# EAGLE design Thruster-Commander (EAGLE 7.4.0)
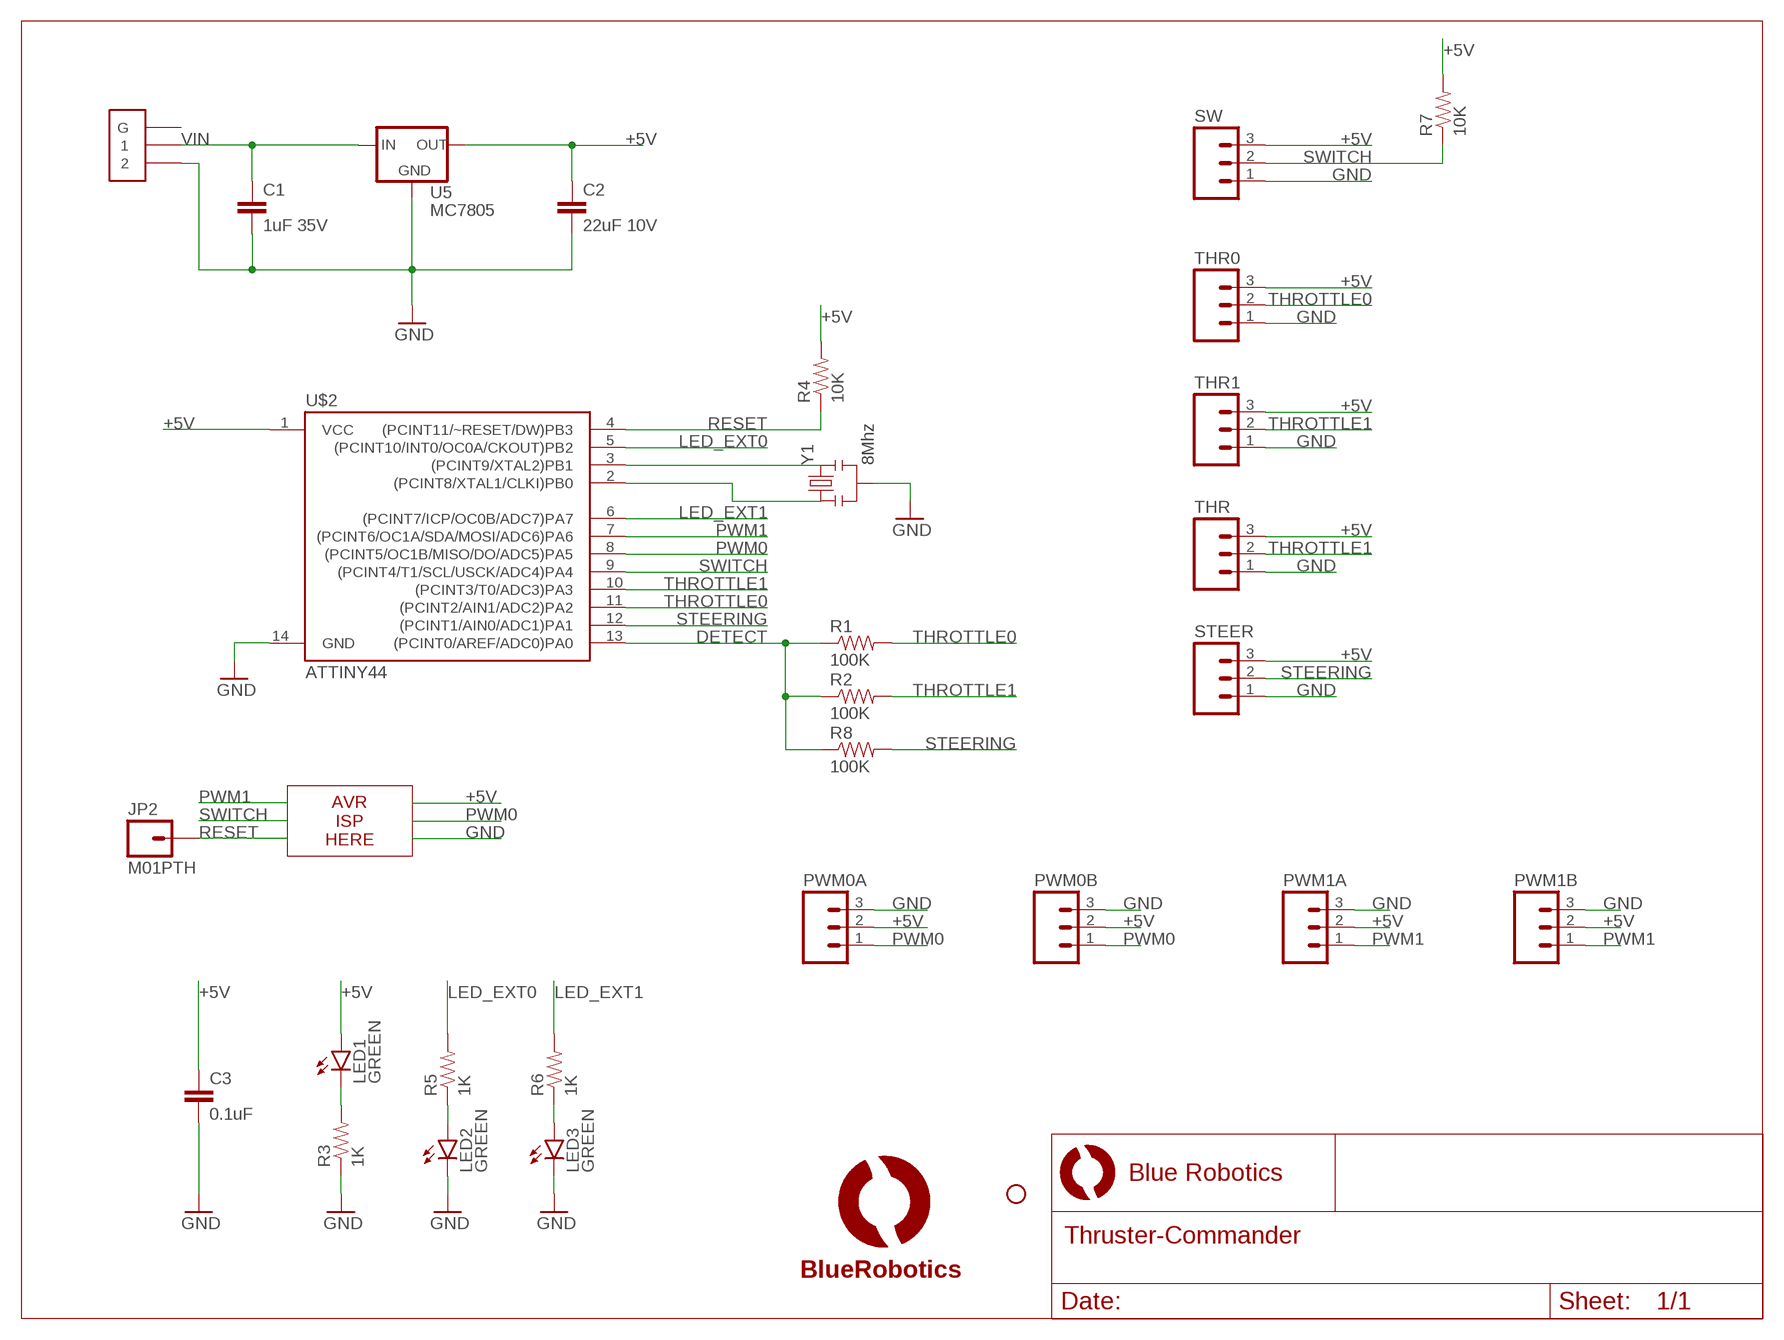
[diagram p0: schematic, sheet 1]

## Parts
C1  1uF 35V  CAP0603-CAP  [0603-CAP]
C2  22uF 10V  CAP1206  [1206]
C3  0.1uF  CAP0603-CAP  [0603-CAP]
JP2  M01PTH  [1X01]
LED1  GREEN  LED0603  [LED-0603]
LED2  GREEN  LED0603  [LED-0603]
LED3  GREEN  LED0603  [LED-0603]
PWM0A  M03PTH  [1X03]
PWM0B  M03PTH  [1X03]
PWM1A  M03PTH  [1X03]
PWM1B  M03PTH  [1X03]
R1  100K  RESISTOR0603  [0603-RES]
R2  100K  RESISTOR0603  [0603-RES]
R3  1K  RESISTOR0603  [0603-RES]
R4  10K  RESISTOR0603  [0603-RES]
R5  1K  RESISTOR0603  [0603-RES]
R6  1K  RESISTOR0603  [0603-RES]
R7  10K  RESISTOR0603  [0603-RES]
R8  100K  RESISTOR0603  [0603-RES]
STANDOFF1  STAND-OFF  [STAND-OFF]
STEER  M03PTH  [1X03]
SW  M03PTH  [1X03]
THR  M03PTH  [1X03]
THR0  M03PTH  [1X03]
THR1  M03PTH  [1X03]
U5  MC7805  78XX  [DPAK]
U$1  LOGOBR-LOGO-MS  [BR-LOGO-MEDIUM-SMALL]
U$2  ATTINY44  ATTINY84  [SO14]
U$3  JSH-GH-2VERT  [JST-GH-TOP-2]
Y1  8Mhz  RESONATORSMD  [RESONATOR-SMD]

## Nets
+5V: C2.1 C3.1 LED1.A PWM0A.2 PWM0B.2 PWM1A.2 PWM1B.2 R4.2 R7.2 STEER.3 SW.3 THR0.3 THR1.3 THR.3 U5.3(OUT) U$2.1(VCC)
DETECT: R1.1 R2.1 R8.1 U$2.13((PCINT0/AREF/ADC0)PA0)
GND: C1.2 C2.2 C3.2 LED2.C LED3.C PWM0A.3 PWM0B.3 PWM1A.3 PWM1B.3 R3.1 STEER.1 SW.1 THR0.1 THR1.1 THR.1 U5.4(GND) U$2.14(GND) U$3.2 Y1.2
LED_EXT0: R5.2 U$2.5((PCINT10/INT0/OC0A/CKOUT)PB2)
LED_EXT1: R6.2 U$2.6((PCINT7/ICP/OC0B/ADC7)PA7)
N$1: LED1.C R3.2
N$2: LED2.A R5.1
N$3: U$2.3((PCINT9/XTAL2)PB1) Y1.3
N$4: U$2.2((PCINT8/XTAL1/CLKI)PB0) Y1.1
N$5: LED3.A R6.1
PWM0: PWM0A.1 PWM0B.1 U$2.8((PCINT5/OC1B/MISO/DO/ADC5)PA5)
PWM1: PWM1A.1 PWM1B.1 U$2.7((PCINT6/OC1A/SDA/MOSI/ADC6)PA6)
RESET: JP2.1 R4.1 U$2.4((PCINT11/~RESET/DW)PB3)
STEERING: R8.2 STEER.2 U$2.12((PCINT1/AIN0/ADC1)PA1)
SWITCH: R7.1 SW.2 U$2.9((PCINT4/T1/SCL/USCK/ADC4)PA4)
THROTTLE0: R1.2 THR0.2 U$2.11((PCINT2/AIN1/ADC2)PA2)
THROTTLE1: R2.2 THR1.2 THR.2 U$2.10((PCINT3/T0/ADC3)PA3)
VIN: C1.1 U5.1(IN) U$3.1
Unconnected: U$3.MECH1(G) U$3.MECH2(G)

## Notes on the sheet
- AVR
  ISP
  HERE

## Library data of the parts
C1-C3 = SparkFun-Capacitors:CAP: Capacitor Standard 0603 ceramic capacitor, and 0.1" leaded capacitor.
JP2 = SparkFun-Connectors:M01: Header 1 Standard 1-pin 0.1" header. Use with straight break away headers (SKU : PRT-00116), right angle break away headers (PRT-00553), swiss pins (PRT-00743), machine pins (PRT-00117), and female headers (PRT-00115).
LED1-LED3 = SparkFun-LED:LED: LEDs Standard schematic elements and footprints for 5mm, 3mm, 1206, and 0603 sized LEDs. 5mm - Spark Fun Electronics SKU : COM-00529 (and others)
PWM0A PWM0B PWM1A PWM1B STEER SW THR THR0 THR1 = SparkFun-Connectors:M03: Header 3 Standard 3-pin 0.1" header. Use with straight break away headers (SKU : PRT-00116), right angle break away headers (PRT-00553), swiss pins (PRT-00743), machine pins (PRT-00117), and female headers (PRT-00115). Molex polarized connector foot print use with SKU : PRT-08232 with associated crimp pins and housings.
R1-R8 = SparkFun-Resistors:RESISTOR: Resistor Basic schematic elements and footprints for 0603, 1206, and PTH resistors.
STANDOFF1 = SparkFun-Electromechanical:STAND-OFF: #4 Stand Off This is the mechanical footprint for a #4 phillips button head screw. Use the keepout ring to avoid running the screw head into surrounding components. SKU : PRT-00447
U5 = BR-Eagle-Library:78XX
U$1 = BlueRobotics-Main:LOGO
U$2 = SparkFun-DigitalIC:ATTINY84: Atmel 14-pin 2/4/8kB flash uC
U$3 = BlueRobotics-JST-GH:JSH-GH-2
Y1 = SparkFun:RESONATOR: Resonator Small SMD resonator. This is the itty bitty 10/20MHz resonators with built in caps. CSTCE10M0G55 and CSTCE20M0V53. Footprint has been reviewed closely but hasn't been tested yet.

## Board
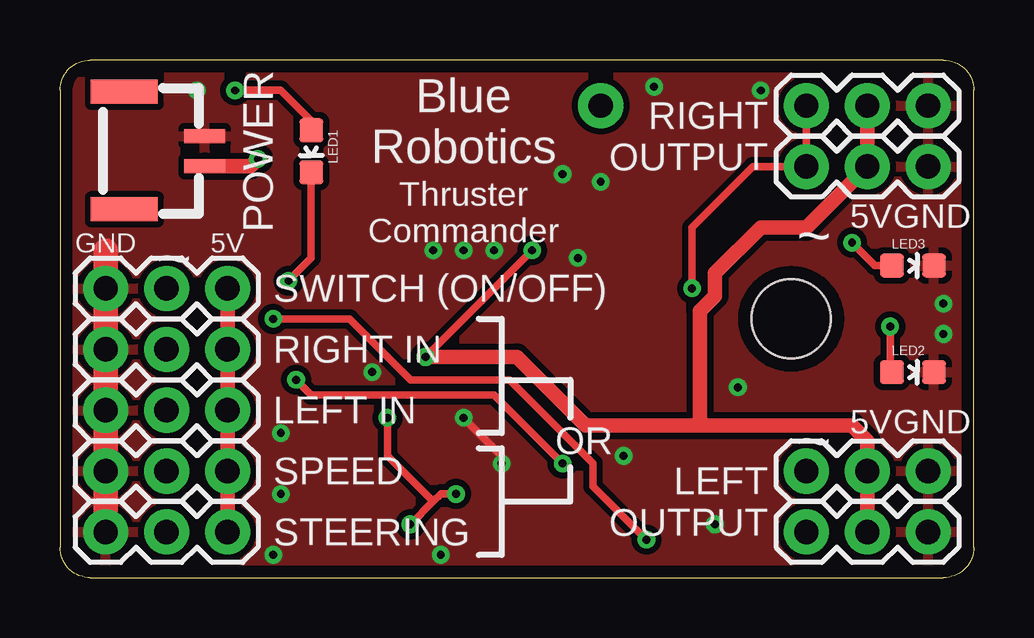
[diagram p1: board, top side]
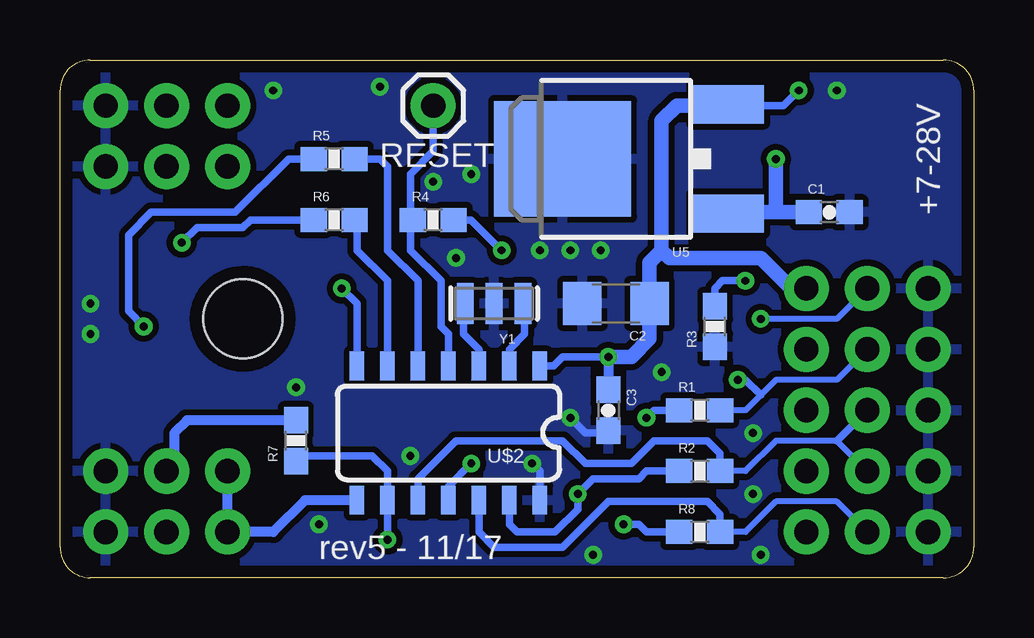
[diagram p2: board, bottom side, seen from below]

Size 38.1 x 21.59 mm. Coordinates in mm from the lower left corner, seen from the top.
Outline: 1.27,0 36.83,0 arc90 38.1,1.27 38.1,20.32 arc90 36.83,21.59 1.27,21.59 arc90 0,20.32 0,1.27 arc90 1.27,0
Copper layers (1*16): Top 0.035mm / dielectric 1.5mm / Bottom 0.035mm
Design rules "default *": minimum track width 10mil, minimum drill 13mil, track to track 8mil, track to pad 8mil, pad to pad 8mil, via to via 8mil, smd to smd 8mil, copper to edge 20mil, drill to drill 8mil, minimum pad ring 10mil, minimum via ring 8mil, stop-mask expansion 4mil, vias tented up to drill 30mil, thermal gap 10mil

### Footprints (pad centres in the part's own frame; a part is rotated, then mirrored left to right if it is on the bottom)
0603-CAP = smd 1.1 x 1: 1 -0.85,0; 2 0.85,0
1206 = smd 1.6 x 1.8: 1 -1.4,0; 2 1.4,0
1X01 = drill 1.016 pad 1.88: 1 0,0
LED-0603 = smd 1 x 1: A 0,-0.877; C 0,0.877
1X03 = drill 1.016 pad 1.88: 1 0,0; 2 2.54,0; 3 5.08,0
0603-RES = smd 1.1 x 1: 1 -0.85,0; 2 0.85,0
STAND-OFF = hole 3.302: 0,0
DPAK = smd 1.6 x 3: 1 -2.28,-5.31; 3 2.28,-5.31 | smd 4.826 x 5.715: 4 0,1.588
SO14 = smd 0.6 x 1.2: 1 -3.81,-2.8; 2 -2.54,-2.8; 3 -1.27,-2.8; 4 0,-2.8; 5 1.27,-2.8; 6 2.54,-2.8; 7 3.81,-2.8; 8 3.81,2.8; 9 2.54,2.8; 10 1.27,2.8; 11 0,2.8; 12 -1.27,2.8; 13 -2.54,2.8; 14 -3.81,2.8
JST-GH-TOP-2 = smd 0.6 x 1.7: 1 1.25,0; 2 0,0 | smd 1 x 2.8: MECH1 3.05,-3.35; MECH2 -1.85,-3.35
RESONATOR-SMD = smd 0.7 x 1.7: 1 -1.2,0; 2 0,0; 3 1.2,0

### Placement (x,y rotation side)
C1  6.03,15.24 0 bottom
C2  14.92,11.43 180 bottom
C3  15.24,6.99 270 bottom
JP2  22.54,19.68 0 bottom
LED1  10.48,17.78 180 top
LED2  35.56,8.57 270 top
LED3  35.56,13.02 270 top
PWM0A  31.11,4.45 0 top
PWM0B  31.11,1.91 0 top
PWM1A  31.11,17.14 0 top
PWM1B  31.11,19.68 0 top
R1  11.43,6.99 0 bottom
R2  11.43,4.45 0 bottom
R3  10.79,10.48 90 bottom
R4  22.54,14.92 0 bottom
R5  26.67,17.46 0 bottom
R6  26.67,14.92 0 bottom
R7  28.26,5.71 90 bottom
R8  11.43,1.91 0 bottom
STANDOFF1  30.48,10.79 0 top
STEER  1.91,1.91 0 top
SW  1.91,12.06 0 top
THR  1.91,4.45 0 top
THR0  1.91,9.53 0 top
THR1  1.91,6.99 0 top
U5  15.56,17.46 90 bottom
U$1  22.86,6.35 0 top
U$2  21.91,6.03 180 bottom
U$3  6.03,18.41 270 top
Y1  20,11.43 180 bottom

### Tracks (layer width: path | path; a pad name or v marks a point on that pad's centre or on a via)
+5V  (via drill 0.33)
  Top 0.305: v19.68,13.65 v15.24,9.21 | LED1.A 10.48,19.05 9.21,20.32 v7.3,20.32
  Top 0.61: SW.3 THR0.3 THR1.3 THR.3 STEER.3 | v15.24,9.21 19.05,9.21 21.91,6.35 26.67,6.35 | 26.67,6.35 33.02,6.35 33.66,5.71 PWM0A.2 PWM0B.2 | PWM1B.2 PWM1A.2 31.11,14.61 29.21,14.61 27.3,12.7 27.3,11.75 26.67,11.11 26.67,6.35
  Bottom 0.305: R4.2 20.95,14.92 v19.68,13.65 | v7.3,20.32 7.94,19.68 10.19,19.68 U5.3 | U$2.1 17.52,8.83 17.14,9.21 v15.24,9.21
  Bottom 0.406: v15.24,9.21 C3.1 | R7.2 32.8,6.57 33.34,6.03 33.34,4.76 PWM0A.2
  Bottom 0.61: v15.24,9.21 14.29,9.21 13.52,9.97 C2.1 13.52,13.15 13.02,13.65 | 13.02,13.65 13.02,19.05 12.38,19.68 10.3,19.68 U5.3 | SW.3 7.62,12.06 8.89,13.34 12.7,13.34 13.02,13.65
DETECT  (via drill 0.33)
  Top 0.305: v16.51,3.49 15.88,3.49 15.56,3.17 | 15.56,3.17 v14.61,2.22 | v13.65,6.67 13.65,5.08 15.56,3.17
  Bottom 0.305: R2.1 13.65,4.45 13.97,4.13 15.88,4.13 v16.51,3.49 16.51,2.86 17.46,1.91 19.05,1.91 19.37,2.22 U$2.13 | v14.61,2.22 13.97,2.22 13.65,1.91 R8.1 | R1.1 13.34,6.99 v13.65,6.67
GND  (via drill 0.33)
  Top 0.305: v18.41,4.76 18.41,5.08 v16.83,6.67
  Top 1.016: 1.91,13.65 1.91,1.59
  Bottom 0.305: U$2.14 18.1,4.45 v18.41,4.76 | v16.83,6.67 16.19,6.03 15.34,6.03 C3.2
  other vias: 13.02,8.57 27.3,2.22 23.5,5.08 28.26,7.94 36.83,11.43 36.83,10.16 29.21,20.32 24.77,20.48 22.54,16.51 5.71,20.32 20.95,16.83 18.1,13.65 16.83,13.65 15.56,13.65 8.89,0.95 15.88,0.95 9.21,3.49 9.21,6.03 21.59,13.34
  pour Top (isolate 0.254): -1.27,22.86 38.1,22.86 38.1,-1.27 -1.27,-1.27
  pour Bottom (isolate 0.254): 0,22.86 39.37,22.86 39.37,-1.27 0,-1.27
LED_EXT0
  Bottom 0.305: U$2.5 23.18,12.38 24.45,13.65 24.45,17.14 24.77,17.46 R5.2
LED_EXT1
  Bottom 0.305: U$2.6 24.45,12.38 25.72,13.65 25.72,14.82 R6.2
N$1  (via drill 0.33)
  Top 0.305: LED1.C 10.48,13.34 v9.53,12.38
  Bottom 0.305: v9.53,12.38 10.48,12.38 10.79,12.06 R3.2
N$2  (via drill 0.33)
  Top 0.305: v34.61,10.48 34.61,8.65 LED2.A
  Bottom 0.305: R5.1 28.57,17.46 30.8,15.24 34.29,15.24 35.24,14.29 35.24,11.11 v34.61,10.48
N$3
  Bottom 0.305: U$2.3 20.64,9.53 21.27,10.16 21.27,11.36 Y1.3
N$4
  Bottom 0.305: U$2.2 19.37,9.53 18.73,10.16 18.73,11.36 Y1.1
N$5  (via drill 0.33)
  Top 0.305: v33.02,13.97 33.97,13.02 LED3.A
  Bottom 0.305: R6.1 30.16,14.92 30.48,14.61 32.38,14.61 v33.02,13.97
PWM0
  Bottom 0.406: U$2.8 27.88,3.23 29.21,1.91 PWM0B.1 PWM0A.1
PWM1  (via drill 0.33)
  Top 0.305: v26.35,12.06 26.35,14.61 28.89,17.14 PWM1A.1 PWM1B.1
  Bottom 0.305: U$2.7 25.72,11.43 v26.35,12.06
RESET
  Bottom 0.305: U$2.4 21.91,10.16 22.23,10.48 22.23,12.38 23.5,13.65 23.5,14.82 R4.1 23.5,15.03 23.5,16.83 22.54,17.78 JP2.1
STEERING
  Bottom 0.254: STEER.2 5.71,3.17 8.26,3.17 9.53,1.91 R8.2
  Bottom 0.305: R8.2 10.58,2.64 11.11,3.17 15.24,3.17 17.14,1.27 20,1.27 20.64,1.91 U$2.12
SWITCH  (via drill 0.33)
  Top 0.305: v8.89,10.79 12.06,10.79 14.61,8.26 18.73,8.26 22.23,4.76 22.23,3.81 v24.45,1.59
  Bottom 0.254: SW.2 5.71,10.79 v8.89,10.79
  Bottom 0.305: R7.1 28.04,5.08 25.08,5.08 24.45,4.45 U$2.9 v24.45,1.59
THROTTLE0  (via drill 0.33)
  Top 0.305: v9.84,8.26 10.48,7.62 18.1,7.62 v20.95,4.76
  Bottom 0.254: THR0.2 5.71,8.26 8.26,8.26 8.89,7.62 9.53,6.99 R1.2
  Bottom 0.305: U$2.11 21.91,3.81 v20.95,4.76 | v9.84,8.26 9.53,8.26 8.89,7.62
THROTTLE1
  Bottom 0.254: THR.2 5.71,5.71 8.26,5.71 9.53,4.45 R2.2
  Bottom 0.305: R2.2 10.58,5.18 11.11,5.71 13.34,5.71 14.29,4.76 16.19,4.76 17.14,5.71 21.59,5.71 23.18,4.13 U$2.10 | THR1.2 5.71,5.71
VIN  (via drill 0.33)
  Top 0.61: U$3.1 7.96,17.16 v8.26,17.46
  Bottom 0.305: 8.26,15.56 7.94,15.24
  Bottom 0.61: C1.1 7.94,15.24 10.19,15.24 U5.1 | v8.26,17.46 8.26,15.56

### Text on the board
tPlace: Blue / Robotics | POWER | RIGHT / OUTPUT | Thruster / Commander | 5V | GND | GND | 5V | ~ | ~ | SWITCH (ON/OFF) | RIGHT IN | LEFT IN | 5V | GND | OR | ~ | SPEED | LEFT / OUTPUT | STEERING
bPlace: RESET | +7-28V | rev5 - 11/17